# Altium schematic sheet medusa-ai-audio.SchDoc
size Legal; SheetNumber: 2; SheetTotal: 2
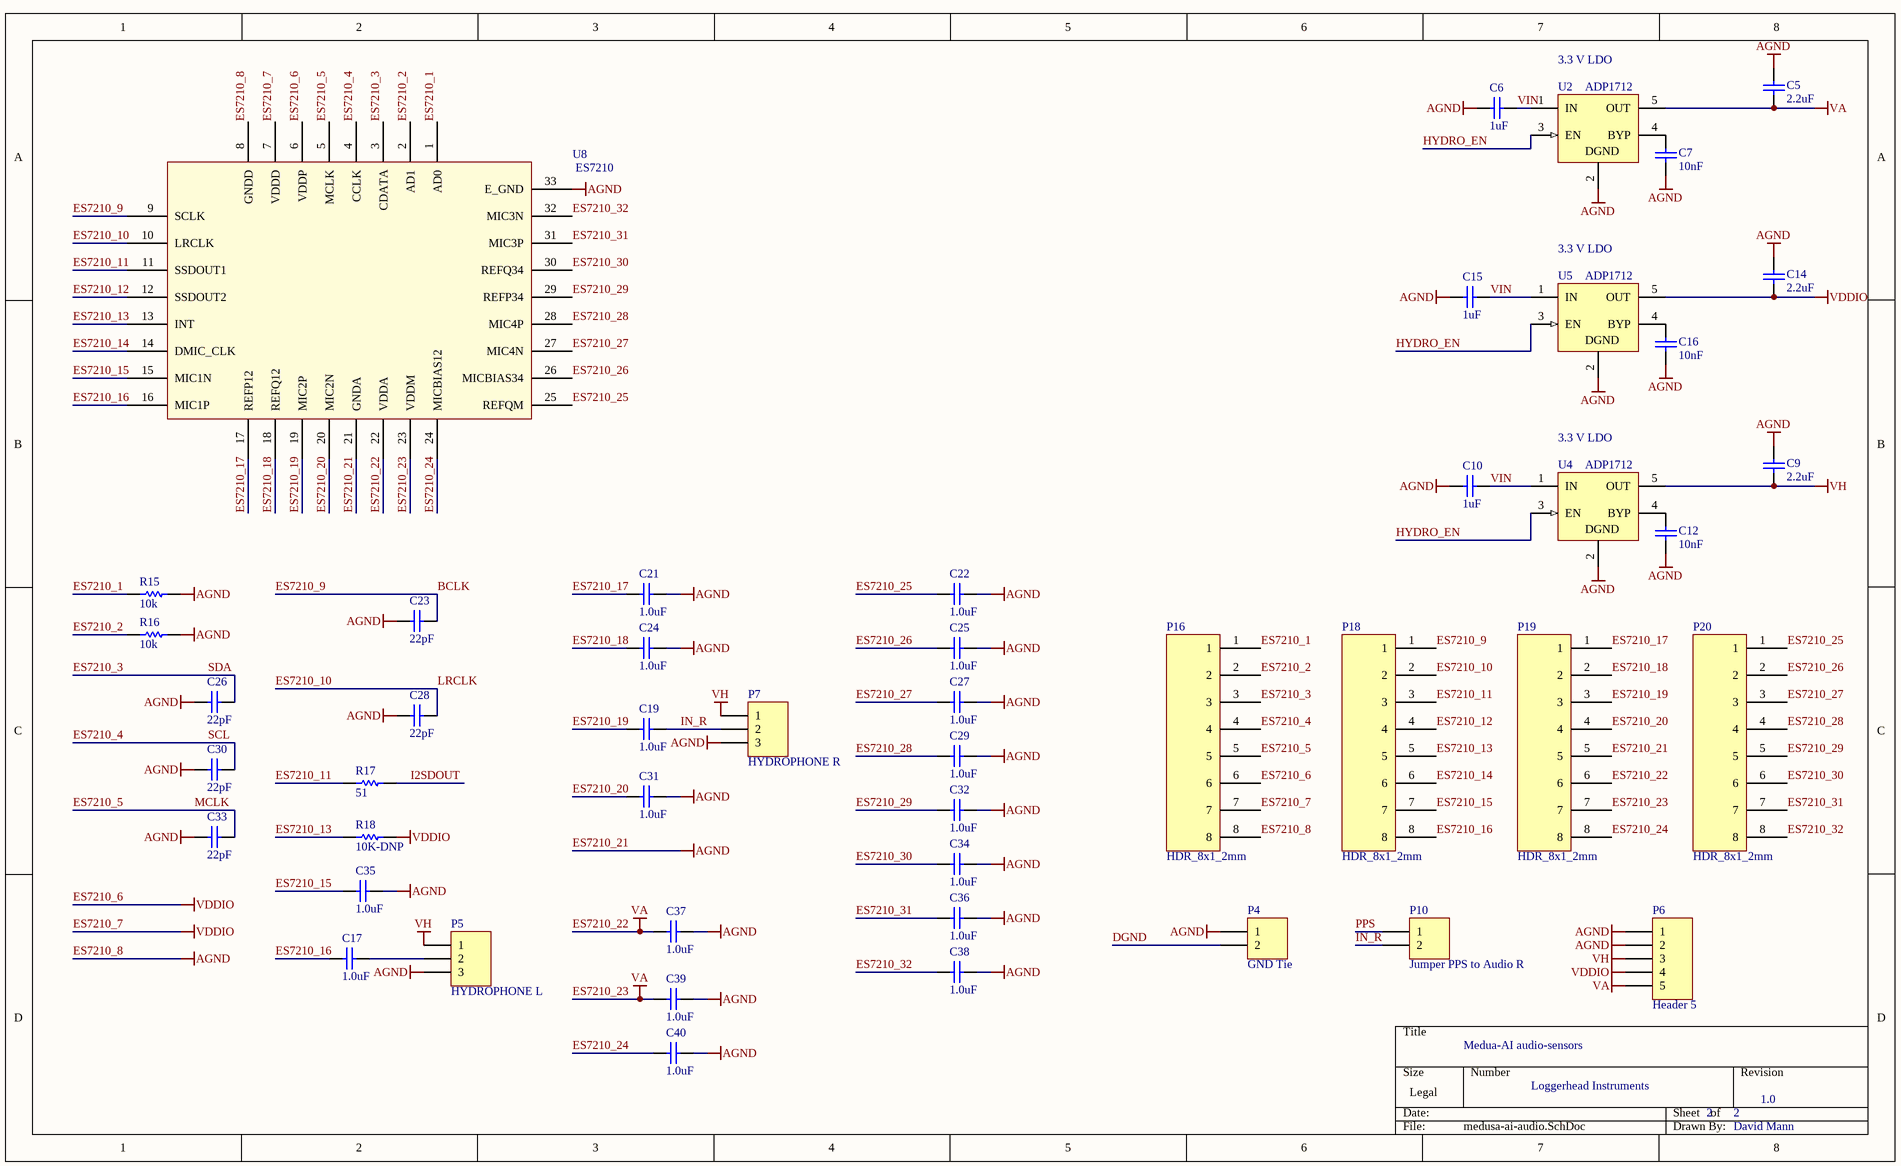
[diagram p0: medusa-ai-audio.SchDoc]

## Parts
C5  2.2uF  [0402]
C6  1uF  [0402]
C7  10nF  [0402]
C9  2.2uF  [0402]
C10  1uF  [0402]
C12  10nF  [0402]
C14  2.2uF  [0402]
C15  1uF  [0402]
C16  10nF  [0402]
C17  1.0uF  [0402]
C19  1.0uF  [0402]
C21  1.0uF  [0402]
C22  1.0uF  [0402]
C23  22pF  [0402]
C24  1.0uF  [0402]
C25  1.0uF  [0402]
C26  22pF  [0402]
C27  1.0uF  [0402]
C28  22pF  [0402]
C29  1.0uF  [0402]
C30  22pF  [0402]
C31  1.0uF  [0402]
C32  1.0uF  [0402]
C33  22pF  [0402]
C34  1.0uF  [0402]
C35  1.0uF  [0402]
C36  1.0uF  [0402]
C37  1.0uF  [0402]
C38  1.0uF  [0402]
C39  1.0uF  [0402]
C40  1.0uF  [0402]
P4  GND Tie  [HDR1X2]
P5  HYDROPHONE L  [HDR1X3]
P6  Header 5  [HDR1X5]
P7  HYDROPHONE R  [HDR1X3]
P10  Jumper PPS to Audio R  [HDR1X2]
P16  HDR_8x1_2mm  [HDR_8x1_2mm]
P18  HDR_8x1_2mm  [HDR_8x1_2mm]
P19  HDR_8x1_2mm  [HDR_8x1_2mm]
P20  HDR_8x1_2mm  [HDR_8x1_2mm]
R15  10k  [3-0603]
R16  10k  [3-0603]
R17  51  [3-0603]
R18  10K-DNP  [3-0603]
U2  ADP1712  [MF05A_N]
U4  ADP1712  [MF05A_N]
U5  ADP1712  [MF05A_N]
U8  ES7210  [ES7210]

## Nets
ES7210_6: C14.1 P6.4 P16.6 P16.7 R18.2 U5.5(OUT) U8.6(VDDP) U8.7(VDDD)  [also labelled ES7210_7, VDDIO]
ES7210_21: C5.2 C6.2 C7.2 C9.2 C10.2 C12.2 C14.2 C15.2 C16.2 C21.1 C22.1 C23.1 C24.1 C25.1 C26.1 C27.1 C28.1 C29.1 C30.1 C31.1 C32.1 C33.1 C34.1 C35.1 C36.1 C37.1 C38.1 C39.1 C40.1 P4.1 P5.3 P6.1 P6.2 P7.3 P16.8 P19.5 R15.2 R16.2 U2.2(GND) U4.2(GND) U5.2(GND) U8.8(GNDD) U8.21(GNDA) U8.33(E_GND)  [also labelled AGND, ES7210_8]
ES7210_22: C5.1 C37.2 C39.2 P6.5 P19.6 P19.7 U2.5(OUT) U8.22(VDDA) U8.23(VDDM)  [also labelled ES7210_23, VA]
VH: C9.1 P5.1 P6.3 P7.1 U4.5(OUT)
BCLK: C23.2 P18.1 U8.9(SCLK)  [also labelled ES7210_9]
DGND: P4.2
ES7210_1: P16.1 R15.1 U8.1(AD0)
ES7210_2: P16.2 R16.1 U8.2(AD1)
ES7210_3: C26.2 P16.3 U8.3(CDATA)  [also labelled SDA]
ES7210_4: C30.2 P16.4 U8.4(CCLK)  [also labelled SCL]
ES7210_5: C33.2 P16.5 U8.5(MCLK)  [also labelled MCLK]
ES7210_10: C28.2 P18.2 U8.10(LRCLK)  [also labelled LRCLK]
ES7210_11: P18.3 R17.1 U8.11(SSDOUT1)
ES7210_12: P18.4 U8.12(SSDOUT2)
ES7210_13: P18.5 R18.1 U8.13(INT)
ES7210_14: P18.6 U8.14(DMIC_CLK)
ES7210_15: C35.2 P18.7 U8.15(MIC1N)
ES7210_16: C17.2 P18.8 U8.16(MIC1P)
ES7210_17: C21.2 P19.1 U8.17(REFP12)
ES7210_18: C24.2 P19.2 U8.18(REFQ12)
ES7210_19: C19.2 P19.3 U8.19(MIC2P)
ES7210_20: C31.2 P19.4 U8.20(MIC2N)
ES7210_24: C40.2 P19.8 U8.24(MICBIAS12)
ES7210_25: C22.2 P20.1 U8.25(REFQM)
ES7210_26: C25.2 P20.2 U8.26(MICBIAS34)
ES7210_27: C27.2 P20.3 U8.27(MIC4N)
ES7210_28: C29.2 P20.4 U8.28(MIC4P)
ES7210_29: C32.2 P20.5 U8.29(REFP34)
ES7210_30: C34.2 P20.6 U8.30(REFQ34)
ES7210_31: C36.2 P20.7 U8.31(MIC3P)
ES7210_32: C38.2 P20.8 U8.32(MIC3N)
HYDRO_EN: U2.3(EN) U4.3(EN) U5.3(EN)
I2SDOUT: R17.2
IN_R: C19.1 P7.2 P10.2
PPS: P10.1
VIN: C6.1 C10.1 C15.1 U2.1(IN) U4.1(IN) U5.1(IN)
NetC7_1: C7.1 U2.4(BYP)
NetC12_1: C12.1 U4.4(BYP)
NetC16_1: C16.1 U5.4(BYP)
NetC17_1: C17.1 P5.2

## Notes on the sheet
- (near U2) 3.3 V LDO
- (near U5) 3.3 V LDO
- (near U4) 3.3 V LDO
- Medua-AI audio-sensors
- Loggerhead Instruments
- 2
- 1.0
- David Mann
- (in symbol LP3985IM5-3.3) DGND

## Library data of the parts
C5-C7 C9 C10 C12 C14-C17 C19 C21-C40 = C0402: Ceramic Chip Capacitor - Standard; Note: Footprint corresponds to dimensions for bulk cassette packaging. This case size has tightened tolerances.; Value: 0.1uF; Published: 17-Jul-2002; LatestRevisionDate: 19-Mar-2004; LatestRevisionNote: Silkscreen size reduced.; DatasheetDocument: Mar-2001; PackageDocument: Mar-2001; PackageReference: 0402; Publisher: Altium Limited; Code_JEITA: 0402; Code_IPC: 1005 [0402]; ComponentLink1Description: Manufacturer Link; ComponentLink1URL: http://www.kemet.com/; ComponentLink2Description: Datasheet; ComponentLink2URL: http://www.kemet.com/kemet/web/homepage/kechome.nsf/vapubfilesname/F3102TA.pdf/$file/F3102TA.pdf
P4 P10 = Header 2: Header, 2-Pin; LatestRevisionDate: 17-Jul-2002; LatestRevisionNote: Re-released for DXP Platform.; Publisher: Altium Limited
P5 P7 = Header 3: Header, 3-Pin; LatestRevisionDate: 17-Jul-2002; LatestRevisionNote: Re-released for DXP Platform.; Publisher: Altium Limited
P6 = Header 5: Header, 5-Pin; LatestRevisionDate: 17-Jul-2002; LatestRevisionNote: Re-released for DXP Platform.; Publisher: Altium Limited
R15-R18 = ERJ3RK: Precision Thick Film Chip Resistor, 10 Ohm to 1M Ohm Range, 1% and 0.5% Tolerance, 0603 Size, 0.063 W; Published: 17-Dec-2003; LatestRevisionDate: 19-Mar-2004; LatestRevisionNote: Silkscreen size reduced.; PackageDocument: Mar-2003; PackageReference: 3-0603; Publisher: Altium Limited; Code_IPC: 1608 [0603]; ComponentLink1Description: Manufacturer Link; ComponentLink1URL: http://www.panasonic.com/industrial/components/resistive_products.htm; ComponentLink2Description: Datasheet; ComponentLink2URL: http://www.panasonic.com/industrial/components/pdf/AOA0000CE2.pdf
U2 U4 U5 = LP3985IM5-3.3: Micropower, 150mA Low-Noise Ultra Low-Dropout CMOS Voltage Regulator; Manufacturer: National Semiconductor; CompType: LDO IC; PackageTopMarking: LDQB*XTT; PowerWise: N; Published: 4-Dec-2008; DatasheetVersion: Aug-2005; PackageVersion: revD, Aug-2008; PackageReference: MF05A; Publisher: Altium Limited; PackageDescription: Molded SOT-23, .115 x .063 x .040 in Body, 5 Lead, .0375 in Pitch; PartNumber: LP3985IM5-3.3; RoHS: O; PinCount: 5; DigiKeyPartNumber: LP3985IM5-3.3CT-ND; ComponentLink1Description: LP3985 Datasheet; ComponentLink1URL: http://www.national.com/ds/LP/LP3985.pdf; ComponentLink2Description: LP3985 Web Page; ComponentLink2URL: http://www.national.com/pf/LP/LP3985.html; ComponentLink3Description: MF05A Package Page; ComponentLink3URL: http://www.national.com/packaging/folders/mf05a.html
U8 = ES7210: Audio CODEC